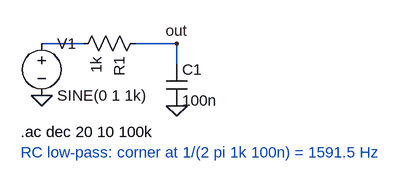
[diagram p0: schematic rc_lowpass.asc]
rc_lowpass.asc, the LTspice schematic file:
Version 4
SHEET 1 1600 1000
WIRE 96 96 32 96
WIRE 240 96 176 96
WIRE 240 128 240 96
FLAG 32 176 0
FLAG 240 192 0
FLAG 240 96 out
SYMBOL voltage 32 80 R0
SYMATTR InstName V1
SYMATTR Value SINE(0 1 1k)
SYMATTR Value2 AC 1
SYMBOL res 192 80 R90
SYMATTR InstName R1
SYMATTR Value 1k
SYMBOL cap 224 128 R0
SYMATTR InstName C1
SYMATTR Value 100n
TEXT 0 232 Left 2 !.ac dec 20 10 100k
TEXT 0 264 Left 2 ;RC low-pass: corner at 1/(2 pi 1k 100n) = 1591.5 Hz

The netlist it stands for:
* rc_lowpass.asc
V1 N001 0 SINE(0 1 1k) AC 1
R1 out N001 1k
C1 out 0 100n
.ac dec 20 10 100k
* RC low-pass: corner at 1/(2 pi 1k 100n) = 1591.5 Hz
.backanno
.end